# Altium schematic sheet VSCPU_Test.SchDoc
size A3; SheetNumber: 1; SheetTotal: 3
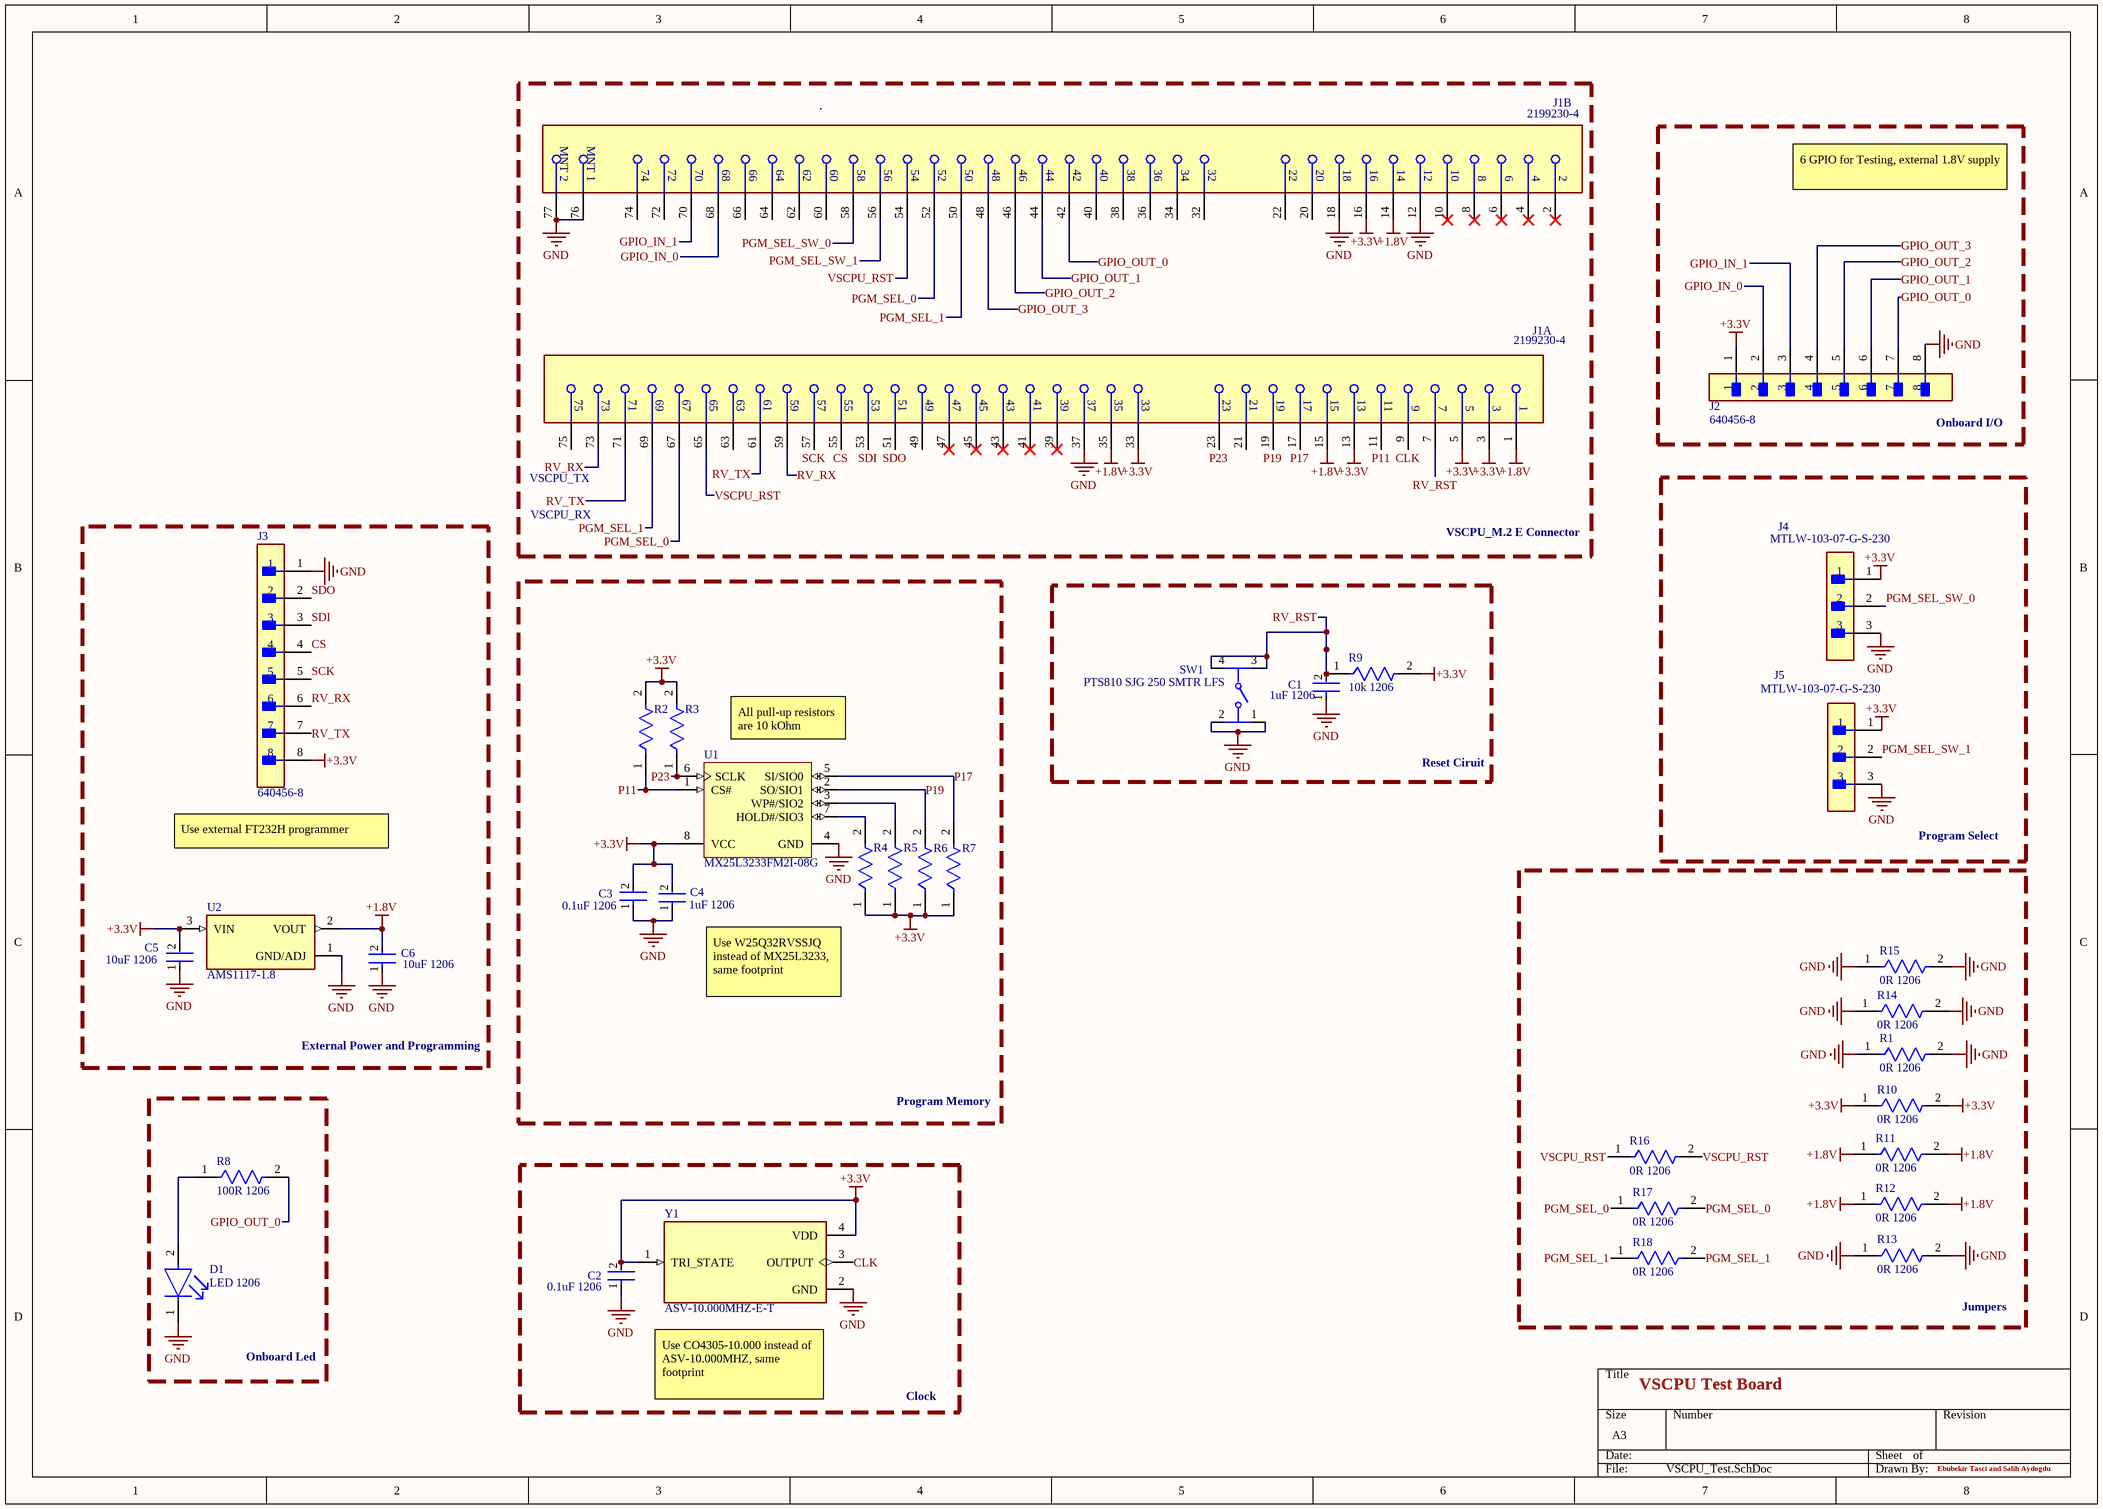
[diagram p0: VSCPU_Test.SchDoc]

## Parts
C1  1uF 1206  [FP-CC1206-1_25-MFG]
C2  0.1uF 1206  [FP-C1206C-EB-MFG]
C3  0.1uF 1206  [FP-C1206C-EB-MFG]
C4  1uF 1206  [FP-CC1206-1_25-MFG]
C5  10uF 1206  [FP-CC1206-FD-MFG]
C6  10uF 1206  [FP-CC1206-FD-MFG]
D1  LED 1206  [FP-LTST-C150KRKT-MFG]
J1  2199230-4  [FP-2199230-4-MFG]  (parts A,B of 2)
J2  640456-8  [FP-640456-8-MFG]
J3  640456-8  [FP-640456-8-MFG]
J4  MTLW-103-07-G-S-230  [FP-MTLW-103-07-G-S-230-MFG]
J5  MTLW-103-07-G-S-230  [FP-MTLW-103-07-G-S-230-MFG]
R1  0R 1206  [FP-MCA1206-MFG]
R2  (no value)  [FP-CRGCQ1206-IPC_C]
R3  (no value)  [FP-CRGCQ1206-IPC_C]
R4  (no value)  [FP-CRGCQ1206-IPC_C]
R5  (no value)  [FP-CRGCQ1206-IPC_C]
R6  (no value)  [FP-CRGCQ1206-IPC_C]
R7  (no value)  [FP-CRGCQ1206-IPC_C]
R8  100R 1206  [FP-MCA1206-IPC_B]
R9  10k 1206  [FP-CRGCQ1206-IPC_C]
R10  0R 1206  [FP-MCA1206-MFG]
R11  0R 1206  [FP-MCA1206-MFG]
R12  0R 1206  [FP-MCA1206-MFG]
R13  0R 1206  [FP-MCA1206-MFG]
R14  0R 1206  [FP-MCA1206-MFG]
R15  0R 1206  [FP-MCA1206-MFG]
R16  0R 1206  [FP-MCA1206-MFG]
R17  0R 1206  [FP-MCA1206-MFG]
R18  0R 1206  [FP-MCA1206-MFG]
SW1  PTS810 SJG 250 SMTR LFS  [FP-PTS810_SJG_250_SMTR_LF-MFG]
U1  MX25L3233FM2I-08G  [MXIC-SOP-8_N]
U2  AMS1117-1.8  [SOT229P700X180-4N]
Y1  ASV-10.000MHZ-E-T  [XTAL_ASV-10.000MHZ-E-T]

## Blocks framed on the sheet
Onboard I/O: J2
Program Select: J4 J5
External Power and Programming: C5 C6 J3 U2
Program Memory: C3 C4 R2-R7 U1
Reset Ciruit: C1 R9 SW1
Jumpers: R1 R10-R18
Onboard Led: D1 R8
Clock: C2 Y1

## Nets
+1.8V: C6.2 J1.1 J1.14 J1.15 J1.35 R11.1 R11.2 R12.1 R12.2 U2.2(VOUT)
+3.3V: C2.2 C3.2 C4.2 C5.2 J1.3 J1.5 J1.13 J1.16 J1.33 J2.1 J3.8 J4.1 J5.1 R2.2 R3.2 R4.1 R5.1 R6.1 R7.1 R9.2 R10.1 R10.2 U1.8(VCC) U2.3(VIN) Y1.1(TRI_STATE) Y1.4(VDD)
GND: C1.1 C2.1 C3.1 C4.1 C5.1 C6.1 D1.1(C) J1.12 J1.18 J1.37 J1.76(MNT_1) J1.77(MNT_2) J2.8 J3.1 J4.3 J5.3 R1.1 R1.2 R13.1 R13.2 R14.1 R14.2 R15.1 R15.2 SW1.1 SW1.2 U1.4(GND) U2.1(GND/ADJ) Y1.2(GND)
CLK: J1.9 Y1.3(OUTPUT)
CS: J1.55 J3.4
GPIO_IN_0: J1.68 J2.2
GPIO_IN_1: J1.70 J2.3
GPIO_OUT_0: J1.42 J2.7 R8.2
GPIO_OUT_1: J1.44 J2.6
GPIO_OUT_2: J1.46 J2.5
GPIO_OUT_3: J1.48 J2.4
P11: J1.11 R2.1 U1.1(CS#)
P17: J1.17 R7.2 U1.5(SI/SIO0)
P19: J1.19 R6.2 U1.2(SO/SIO1)
P23: J1.23 R3.1 U1.6(SCLK)
PGM_SEL_0: J1.52 J1.67 R17.1 R17.2
PGM_SEL_1: J1.50 J1.69 R18.1 R18.2
PGM_SEL_SW_0: J1.58 J4.2
PGM_SEL_SW_1: J1.56 J5.2
RV_RST: C1.2 J1.7 R9.1 SW1.3 SW1.4
RV_RX: J1.59 J1.73 J3.6
RV_TX: J1.61 J1.71 J3.7
SCK: J1.57 J3.5
SDI: J1.53 J3.3
SDO: J1.51 J3.2
VSCPU_RST: J1.54 J1.65 R16.1 R16.2
NetD1_2: D1.2(A) R8.1
NetR4_2: R4.2 U1.7(HOLD#/SIO3)
NetR5_2: R5.2 U1.3(WP#/SIO2)

Not connected (* = marked no-connect by the designer): J1 2* 4* 6* 8* 10* 20 21 22 32 34 36 38 39* 40 41* 43* 45* 47* 49 60 62 63 64 66 72 74 75

## Notes on the sheet
- 6 GPIO for Testing, external 1.8V supply
- (near J1) VSCPU_TX
- VSCPU_RX
- VSCPU_M.2 E Connector
- All pull-up resistors are 10 kOhm
- Use external FT232H programmer
- Use W25Q32RVSSJQ instead of MX25L3233, same footprint
- Use CO4305-10.000 instead of ASV-10.000MHZ, same footprint
- VSCPU Test Board
- Ebubekir Tasci and Salih Aydogdu

## Library data of the parts
C1 C4 = CMP-03422-001171-1: CAP CER 1UF 10V X7R 1206 / CC1206KKX7R6BB105; Manufacturer: Yageo; Material: Ceramic; Tolerance: 0.1; Automotive Grade: NA; Temperature Coefficient: 15%; Category: Cap; Package: CC1206-1.25; Device Class L3: Ceramic Capacitors; Footprint Url: http://www.yageo.com/exep/pages/download/literatures/UPY-C_GEN_24.pdf; Octopart: https://octopart.com/cc1206kkx7r6bb105-yageo-21769912; Temperature Range High: +125°C; Lead Free: Yes; Capacitance: 1 uF; Voltage Rating: 10 V; ComponentLink2Description: Datasheet; ComponentLink2URL: http://www.yageo.com/documents/recent/UPY-NP0X7R_HV_1KV-to-3KV_11.pdf; Height: 1.45mm; Device Class L1: Passive Components; Temperature Range Low: -55°C; Value: 1 uF; Device Class L2: Capacitors; Digikey Description: CAP CER 1UF 10V X7R 1206; RoHS: TRUE; Mouser Description: Multilayer Ceramic Capacitors MLCC - SMD/SMT 1.0uF 10V X7R 10%; Temperature Characteristic: X7R; Automotive: No; Temperature: -55°C to +125°C; Manufacturer Part Number: CC1206KKX7R6BB105
C2 C3 = CMP-1037-04220-3: CAP CER 0.1UF 200V X7R 1206 / C1206C104J2RACTU; Manufacturer: KEMET; Automotive Grade: Grade 0; Value: 0.10 μF; Temperature Coefficient: 15%; Material: Ceramic; Tolerance: 0.05; Digikey Description: CAP CER 0.1UF 200V X7R 1206; Lead Free: Yes; Ipc Land Pattern Name: CAPC320160X78; Voltage Rating: 200 V; ComponentLink2URL: https://content.kemet.com/datasheets/KEM_C1007_X8R_ULTRA_150C_SMD.pdf; Device Class L1: Passive Components; RoHS: TRUE; Device Class L3: Ceramic Capacitors; Package: C1206C-EB; Height: 0.88mm; Temperature: -55°C to +150°C; Temperature Range High: +150°C; Capacitance: 0.10 μF; ComponentLink2Description: Datasheet; Manufacturer Part Number: C1206C104J2RACTU; Automotive: Yes; Temperature Range Low: -55°C; Temperature Characteristic: X7R; Device Class L2: Capacitors; Octopart: https://octopart.com/c1206c104j2ractu-kemet-10471706; Category: Cap
C5 C6 = CMP-03422-001420-1: CAP CER 10UF 50V X5R 1206 / CC1206KKX5R9BB106; Tolerance: 10%; Voltage Rating (DC): 50V; Width: 0.063inch; Halogen Free: Halogen Free; Mount: Surface Mount; Dielectric: X5R; Max Operating Temperature: 85°C; Capacitance: 10uF; Case/Package: 1206; Voltage Rating: 50V; Lead Free: Lead Free; Thickness: 0.075inch; Min Operating Temperature: -55°C; Length: 0.126inch; Packaging: Tape and Reel; RoHS Compliant: Yes
D1 = CMP-2000-06617-2: LED RED CLEAR 1206 SMD / LTST-C150KRKT; Wavelength: 639nm; Power Dissipation: 62.5mW; Luminous Intensity: 54mcd; Test Current: 20mA; Forward Current: 30mA; Reverse Voltage: 5V; Viewing Angle: 130°; Number of Elements: 1; Lens Style: Diffused; Power Rating: 75mW; Lens Color: Colorless; Forward Voltage: 2V; Dominant Wavelength: 631nm; Depth: 1.6mm; Mount: Surface Mount; Packaging: Tape and Reel; Case Code (Metric): 3216; Lens Transparency: Clear; Illumination Color: Red; Radiation Hardening: No; Min Operating Temperature: -30°C; Height: 1.1mm; Case Code (Imperial): 1206; Number of Pins: 2; Length: 3.2mm; Lead Free: Lead Free; Color: Red; Width: 1.6mm; Number of LEDs: 1; Max Operating Temperature: 85°C; Case/Package: 1206; Package Quantity: 1
J1 = CMP-03365-000002-1: CONN FEMALE 67POS 0.020 GOLD; Manufacturer: TE Connectivity; Conn Orientation: Right Angle; Pitch: 0.5mm; Number Of Contacts: 67; Voltage Rating: 50V; Is Female: yes; Current Rating: 0.5A; Lead Free: Yes; Temperature Range Low: -40°C; Device Class L3: unset; Package: 0; Manufacturer Part Number: 2199230-4; RoHS: TRUE; Digikey Description: CONN FEMALE 67POS 0.020 GOLD; Category: Conn; Device Class L1: Connectors; Temperature Range High: +80°C; ComponentLink2Description: Datasheet; ComponentLink2URL: https://www.te.com/commerce/DocumentDelivery/DDEController?Action=showdoc&DocId=Customer+Drawing%7F2199230%7FB3%7Fpdf%7FEnglish%7FENG_CD_2199230_B3.pdf%7F2199230-4; Mouser Description: PCI Express / PCI Connectors .5PITCH 4.2H KEY E EMBOSS NGFF MINICARD; Automotive: No; Conn Gender: Female; Height: 4.2mm; Device Class L2: Card Edge Connectors; Contact Material: Gold,Nickel; Number Of Rows: 2; Octopart: https://octopart.com/2199230-4-te+connectivity-46436156; Temperature: -40°C to +80°C
J2 J3 = CMP-03369-000098-1: CONN HEADER VERT 8POS 2.54MM; RoHS Compliant: Yes
J4 J5 = CMP-02766-001679-1: CONN HEADER VERT 3POS 2.54MM; Max Current Rating: 3A; Number of Contacts: 3; Gender: Male; Contact Material: Bronze; Pitch: 2.54mm; Housing Material: Polymer; Contact Plating: Gold; Radiation Hardening: No; Depth: 2.48mm; Packaging: Bulk; Number of Rows: 1; Max Operating Temperature: 125°C; Housing Color: Black; Termination: Solder; Min Operating Temperature: -55°C; Length: 7.62mm; RoHS Compliant: Yes; Orientation: Straight
R1 R10-R18 = CMP-02407-001388-1: Res MC Professional Thin Film 1206 0Ω Jumper 0.4W Molded Paper T/R / MCA12060Z0000ZP500
R2-R7 R9 = CMP-03211-010884-1: CRGCQ1206 10KΩ 0.25W 1% ±100ppm/°C 200VCRGCQ1206F10K; Manufacturer: TE Connectivity; Voltage Rating: 200V; Tolerance: 0.01; Automotive Grade: Grade 913; Value: 10KΩ; Automotive: Yes; Temperature: -55°C to +155°C; RoHS: TRUE; Series: CRGCQ; Lead Free: Yes; Device Class L3: Chip SMD Resistors; Package: CRGCQ1206; ComponentLink2URL: https://www.te.com/commerce/DocumentDelivery/DDEController?Action=showdoc&DocId=Data+Sheet%7F1773204-3%7F1%7Fpdf%7FEnglish%7FENG_DS_1773204-3_1.pdf%7F4-2176347-922; Ipc Land Pattern Name: RESC310155X55; Composition: Thick Film; Device Class L1: Passive Components; Temperature Range Low: -55°C; Resistance: 10KΩ; Height: 0.65mm; Power Rating: 0.25W; Device Class L2: Resistors; Temperature Range High: +155°C; Octopart: https://octopart.com/crgcq1206f10k-te+connectivity-91018244; Ambient Temperature Range High: +70°C; ComponentLink2Description: Datasheet; Temperature Coefficient: ±100ppm/°C; Manufacturer Part Number: CRGCQ1206F10K; Category: Res
R8 = CMP-02407-009304-1: Res MC AT Professional Thin Film 1206 100Ω 0.5% 0.4W ±25ppm/°C Molded Paper T/R / MCA1206MD1000DP500; Power Rating: 400mW; Voltage Rating: 200V; Height: 0.55mm; Min Operating Temperature: -55°C; Case Code (Metric): 3216; Max Operating Temperature: 175°C; Case Code (Imperial): 1206; Composition: Thin Film; Length: 3.2mm; Case/Package: 1206; Packaging: Tape and Reel; Width: 1.6mm; Resistance: 100R; Weight: 0.000325oz; Tolerance: 0.5%
SW1 = CMP-10040-000011-1: SWITCH TACTILE SPST-NO 0.05A 16V; Manufacturer: C&K Components; Electromechanical Life: 100000Cycles; Contact Resistance: 500mΩ; Operating Force: 400gf; Current Rating: 50mA; Voltage Rating Dc: 16V; Device Class L2: Switches; Device Class L1: Electromechanical; ComponentLink2URL: https://www.ckswitches.com/media/1476/pts810.pdf; Digikey Description: SWITCH TACTILE SPST-NO 0.05A 16V; RoHS: TRUE; Temperature Range Low: -40°C; Temperature Range High: +85°C; Automotive: No; Category: Switch; ComponentLink2Description: Datasheet; Device Class L3: Tactile Switches; Mouser Description: Switch Tactile N.O. SPST Button J-Bend 0.05A 16VDC 100000Cycles 3.92N SMD T/R; Throw Configuration: SPST-NO; Package: PTS810 SJG 250 SMTR LFS; Height: 2.7mm; Octopart: https://octopart.com/pts810sjg250smtrlfs-c%26k+components-29380277; Manufacturer Part Number: PTS810 SJG 250 SMTR LFS; Temperature: -40°C to +85°C; Lead Free: Yes
U1 = CMP-2000-05278-1: CMOS MXSMIO(R) (Serial Multi I/O) Flash Memory, 32 Mbits (x1/x2/x4), 3 V, -40 to 85 degC, 8-Pin SOP; Manufacturer: Macronix; Manufacturer URL: http://www.macronix.com; Package Description: 8-Pin Small Outline Package, Body 5.23 x 5.28 mm, Pitch 1.27 mm; Datasheet URL: http://datasheet.octopart.com/MX25L3233FM2I-08G-Macronix-datasheet-38883555.pdf; Datasheet Version: Rev. 1.1, 01/2015; Package Reference: SOP-8
U2 = CMP-031-000000-1: Design Item ID: AMS1117-1.8; Value: *; Availability: Unavailable; Price: None; Component Type: Standard; Pin Count: 3; Source: AMS1117-1.8.SchLib; Package: None; MP: AMS1117-1.8
Y1 = CMP-033-000000-1: Source: ASV-10.000MHZ-E-T.SchLib; Price: None; Value: *; Pin Count: 4; MP: ASV-10.000MHZ-E-T; Package: None; Availability: Unavailable; Component Type: Standard; Design Item ID: ASV-10.000MHZ-E-T